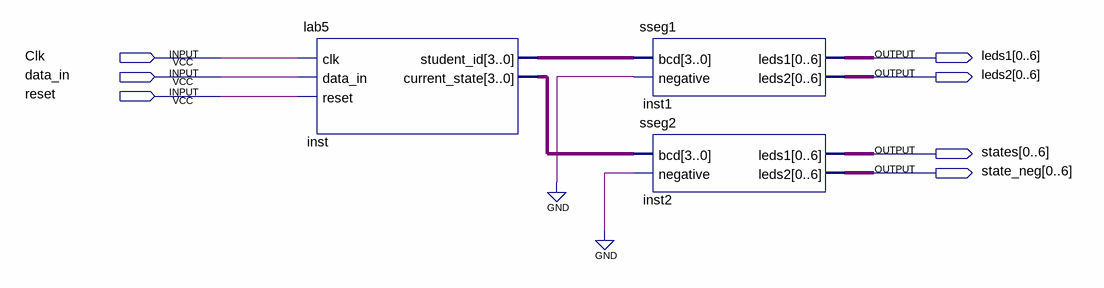
[diagram p0: schematic sheet]
// Quartus schematic lab5.bdf as structural Verilog: 3 symbols, 7 pins
module lab5 (
  input  Clk,
  input  data_in,
  input  reset,
  output [0:6] leds1,
  output [0:6] leds2,
  output [0:6] states,
  output [0:6] state_neg
);

  wire [3:0] inst_current_state, inst_student_id;

  lab5 inst (
    .clk(Clk), .data_in(data_in), .reset(reset), .student_id(inst_student_id),
    .current_state(inst_current_state));
  sseg1 inst1 (.bcd(inst_student_id), .negative(1'b0), .leds1(leds1), .leds2(leds2));
  sseg2 inst2 (.bcd(inst_current_state), .negative(1'b0), .leds1(states), .leds2(state_neg));
endmodule
